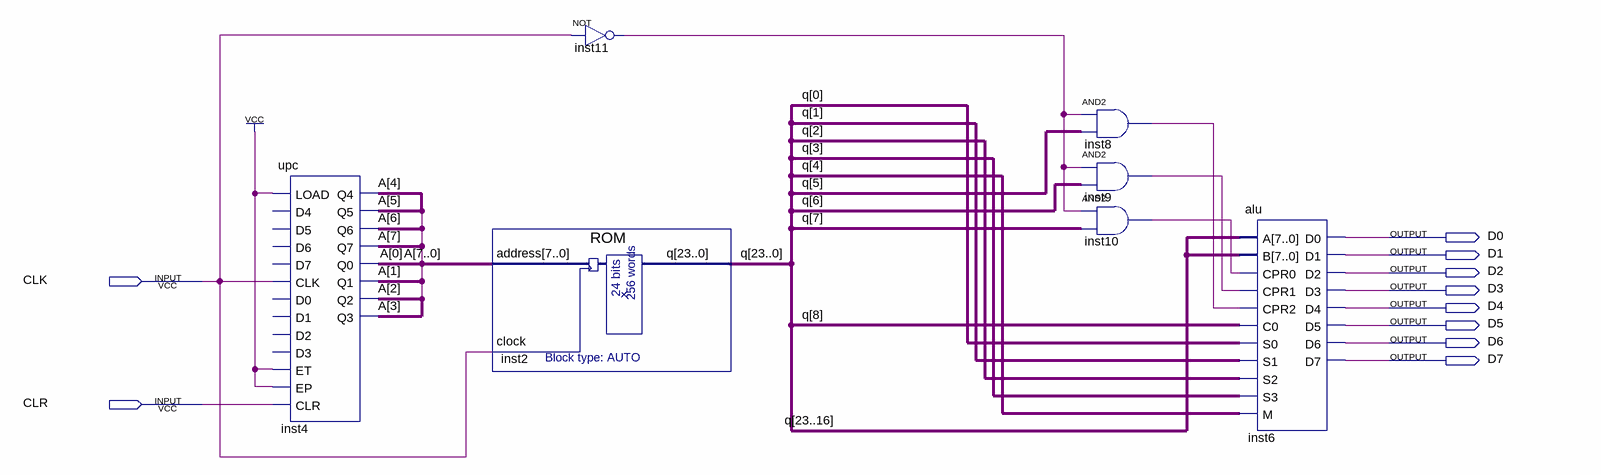
[diagram p0: schematic sheet]
// Quartus schematic ex1.bdf as structural Verilog: 7 symbols, 10 pins
module ex1 (
  input  CLK,
  input  CLR,
  output D0,
  output D1,
  output D2,
  output D3,
  output D4,
  output D5,
  output D6,
  output D7
);

  wire inst8_out, inst9_out, inst10_out, inst11_out;
  wire [7:0] A;
  wire [23:0] q;

  upc inst4 (
    .LOAD(1'b1), .CLK(CLK), .ET(1'b1), .EP(1'b1), .CLR(CLR), .Q4(A[4]), .Q5(A[5]), .Q6(A[6]), .Q7(A[7]),
    .Q0(A[0]), .Q1(A[1]), .Q2(A[2]), .Q3(A[3]));  // open: D4, D5, D6, D7, D0, D1, D2, D3
  ROM inst2 (.address(A), .clock(CLK), .q(q));
  not inst11 (inst11_out, CLK);
  and inst8 (inst8_out, inst11_out, q[5]);
  and inst9 (inst9_out, inst11_out, q[6]);
  and inst10 (inst10_out, inst11_out, q[7]);
  alu inst6 (
    .A(q[23:16]), .CPR0(inst10_out), .B(q[23:16]), .CPR1(inst9_out), .C0(q[8]), .S0(q[0]), .S1(q[1]),
    .S2(q[2]), .S3(q[3]), .M(q[4]), .CPR2(inst8_out), .D0(D0), .D1(D1), .D2(D2), .D3(D3), .D4(D4), .D5(D5),
    .D6(D6), .D7(D7));
endmodule
